# Altium schematic sheet 009_SoC SDIO & eMMC & SD.SchDoc
size 420 x 297 mm; Page Create Date: May 29, 2006; WebSite: https://www.seeedstudio.com; Page Number: 9; Drawing: qxn; Schematic Name: BeaglePlay; Page Size: A3; Comment: Seeed Title; Page Count: 22; Page Name: 009_SoC SDIO & eMMC & SD; Company: Seeed Studio; RevCode: v0.2; DsnPath: C:\Users\a0488739\Documents\GitHub\beagleplay\allegro\DVT\BEAGLEPLAYV020_220915.DSN; SchematicName: BeaglePlay; PageName: 009_SoC SDIO & eMMC & SD; PageSize: A3; TopSchematic: True
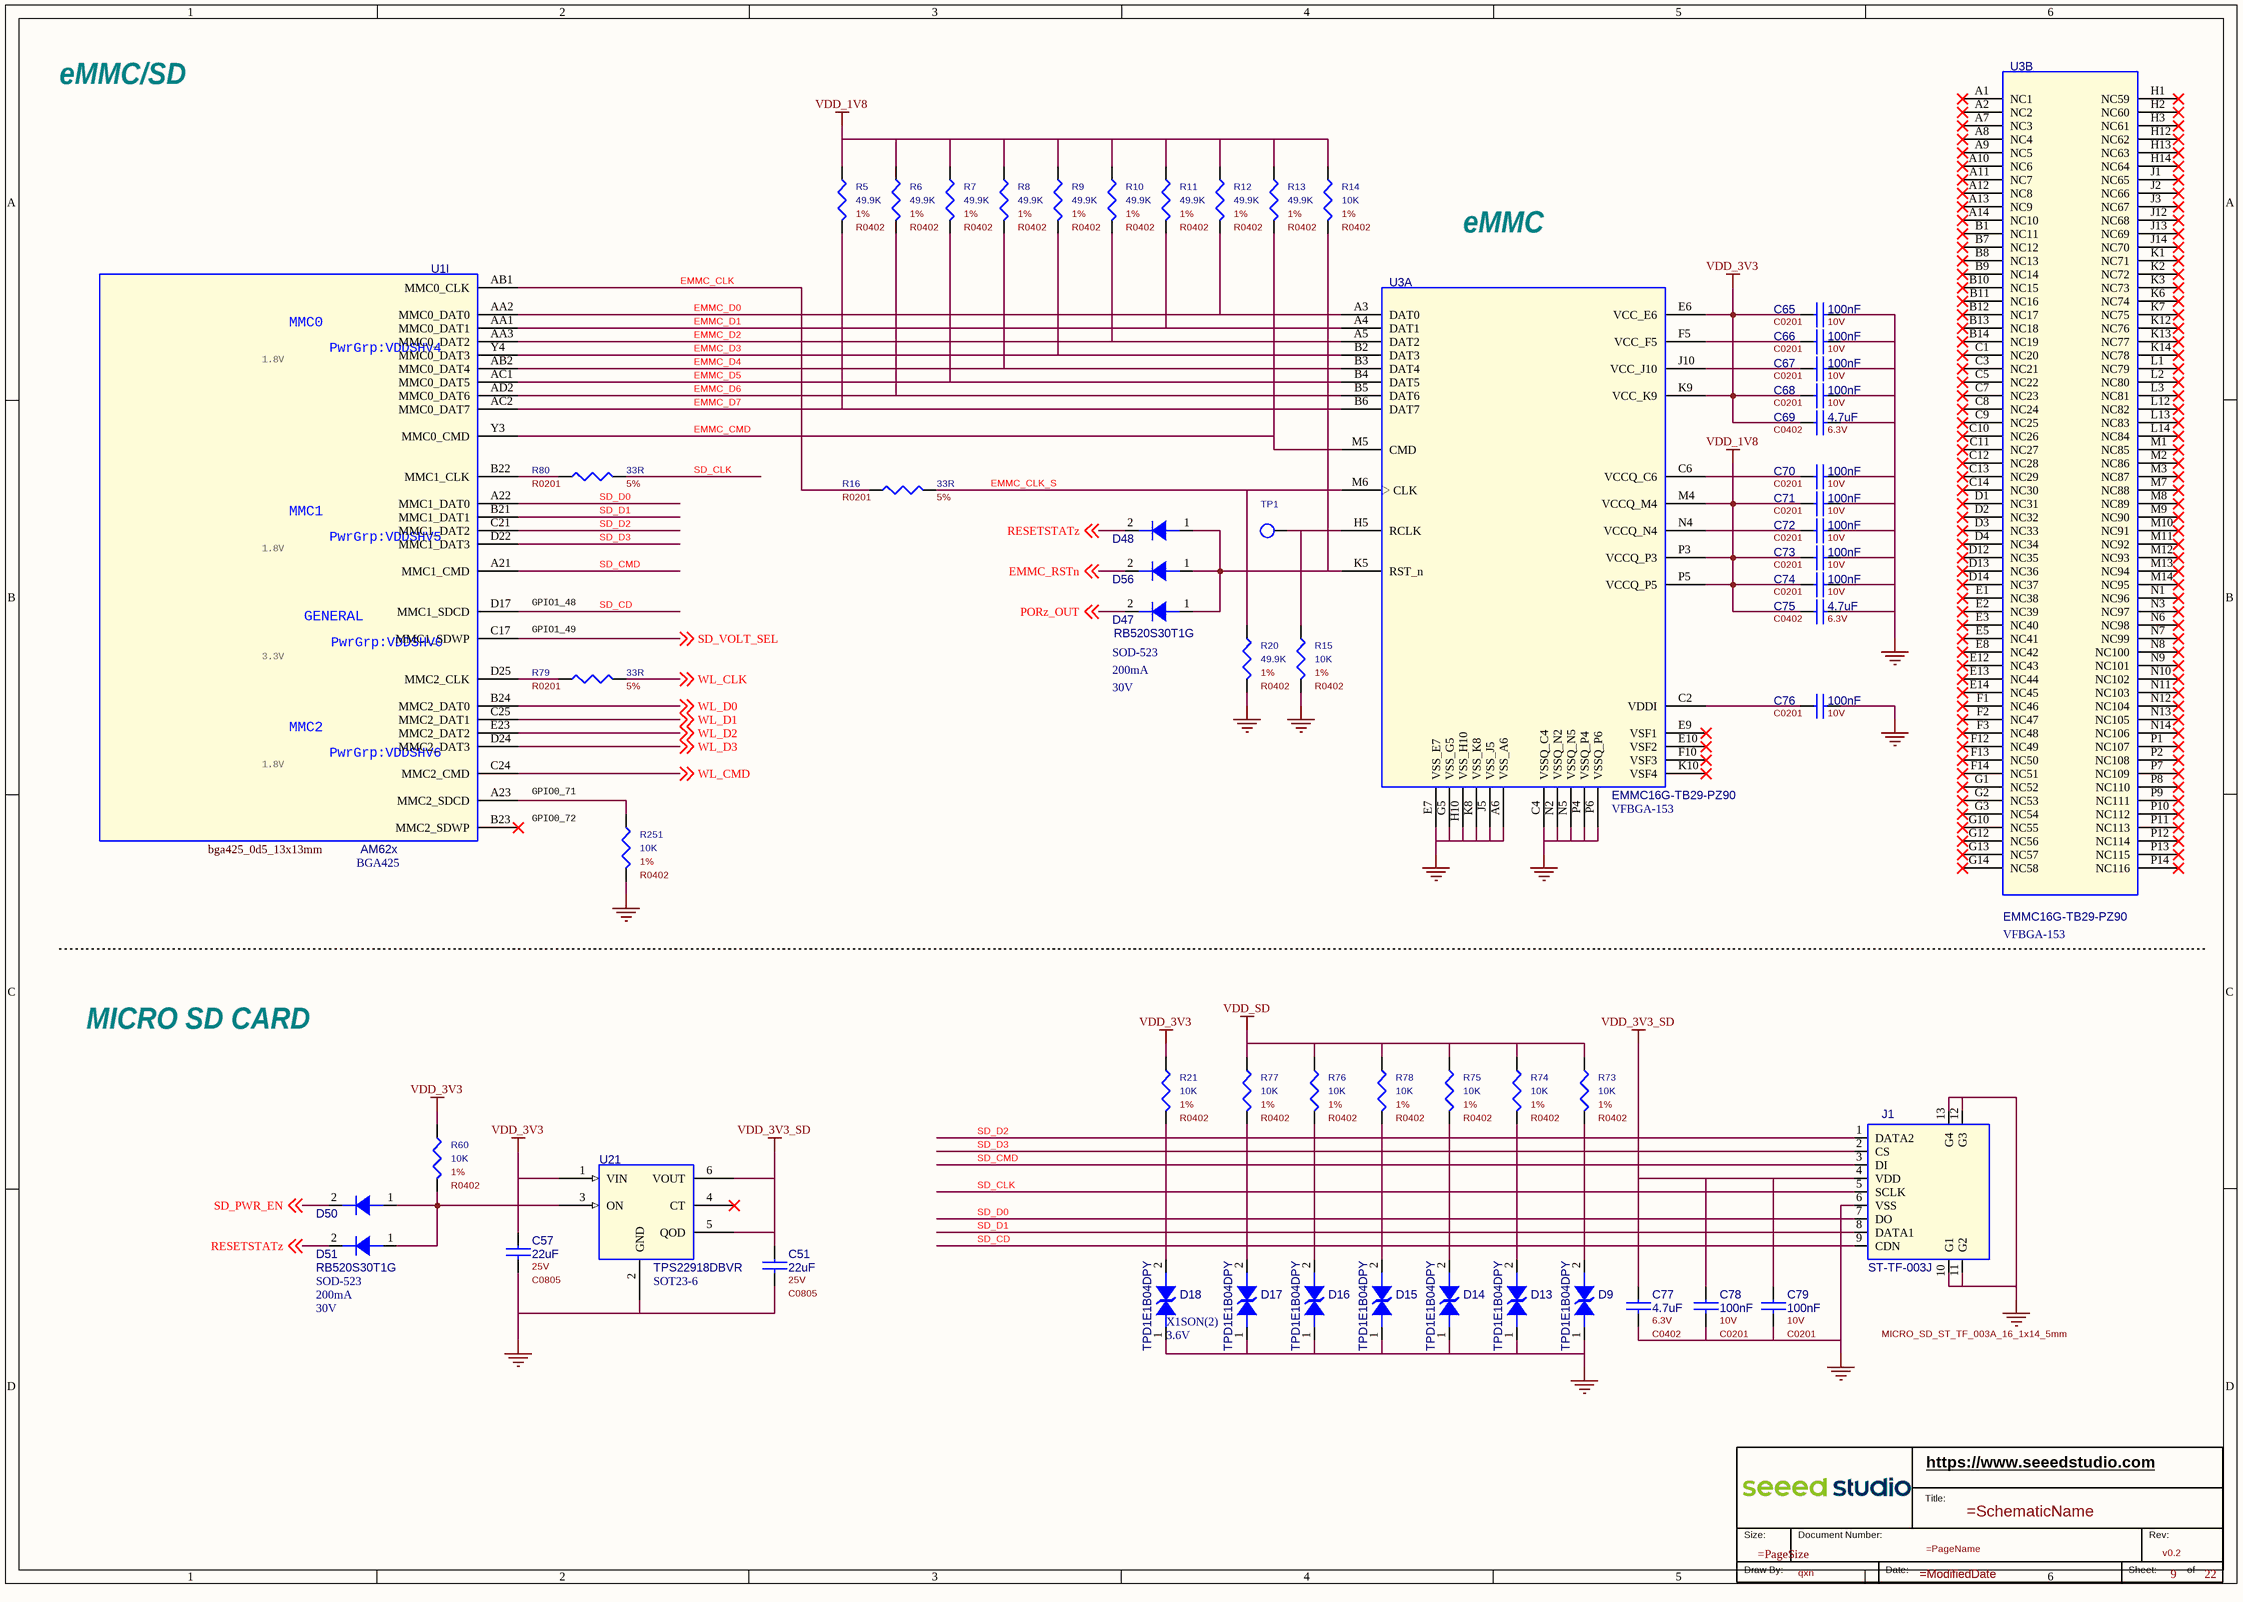
[diagram p0: 009_SoC SDIO & eMMC & SD.SchDoc]

## Parts
*  RevCode: v0.2  Page Number: 9  Page Count: 22  Drawing: qxn  (hidden comment: Seeed Title)  (graphical)
C51  value 22uF  Rating: 25V  [C0805]  (hidden comment: CC)
C57  value 22uF  Rating: 25V  [C0805]  (hidden comment: CC)
C65  value 100nF  Rating: 10V  [C0201]  (hidden comment: CC)
C66  value 100nF  Rating: 10V  [C0201]  (hidden comment: CC)
C67  value 100nF  Rating: 10V  [C0201]  (hidden comment: CC)
C68  value 100nF  Rating: 10V  [C0201]  (hidden comment: CC)
C69  value 4.7uF  Rating: 6.3V  [C0402]  (hidden comment: CC)
C70  value 100nF  Rating: 10V  [C0201]  (hidden comment: CC)
C71  value 100nF  Rating: 10V  [C0201]  (hidden comment: CC)
C72  value 100nF  Rating: 10V  [C0201]  (hidden comment: CC)
C73  value 100nF  Rating: 10V  [C0201]  (hidden comment: CC)
C74  value 100nF  Rating: 10V  [C0201]  (hidden comment: CC)
C75  value 4.7uF  Rating: 6.3V  [C0402]  (hidden comment: CC)
C76  value 100nF  Rating: 10V  [C0201]  (hidden comment: CC)
C77  value 4.7uF  Rating: 6.3V  [C0402]  (hidden comment: CC)
C78  value 100nF  Rating: 10V  [C0201]  (hidden comment: CC)
C79  value 100nF  Rating: 10V  [C0201]  (hidden comment: CC)
D9  value TPD1E1B04DPY  [D0402]  (hidden comment: DIODE TVS BI-DIR)
D13  value TPD1E1B04DPY  [D0402]  (hidden comment: DIODE TVS BI-DIR)
D14  value TPD1E1B04DPY  [D0402]  (hidden comment: DIODE TVS BI-DIR)
D15  value TPD1E1B04DPY  [D0402]  (hidden comment: DIODE TVS BI-DIR)
D16  value TPD1E1B04DPY  [D0402]  (hidden comment: DIODE TVS BI-DIR)
D17  value TPD1E1B04DPY  [D0402]  (hidden comment: DIODE TVS BI-DIR)
D18  value TPD1E1B04DPY  Package Size: X1SON(2)  Rated Voltage: 3.6V  [D0402]  (hidden comment: DIODE TVS BI-DIR)
D47  value RB520S30T1G  Package Size: SOD-523  Peak Forward Current: 200mA  Repetitive Reverse Voltage Maximum: 30V  [sod_523]  (hidden comment: D)
D48  D  [sod_523]  (value not drawn)
D50  D  [sod_523]  (value not drawn)
D51  value RB520S30T1G  Repetitive Reverse Voltage Maximum: 30V  Peak Forward Current: 200mA  Package Size: SOD-523  [sod_523]  (hidden comment: D)
D56  D  [sod_523]  (value not drawn)
J1  value ST-TF-003J  [MICRO_SD_ST_TF_003A_16_1x14_5mm]  (hidden comment: MicroSD Card_9+4P)
R5  value 49.9K  Rating: 1%  [R0402]  (hidden comment: R)
R6  value 49.9K  Rating: 1%  [R0402]  (hidden comment: R)
R7  value 49.9K  Rating: 1%  [R0402]  (hidden comment: R)
R8  value 49.9K  Rating: 1%  [R0402]  (hidden comment: R)
R9  value 49.9K  Rating: 1%  [R0402]  (hidden comment: R)
R10  value 49.9K  Rating: 1%  [R0402]  (hidden comment: R)
R11  value 49.9K  Rating: 1%  [R0402]  (hidden comment: R)
R12  value 49.9K  Rating: 1%  [R0402]  (hidden comment: R)
R13  value 49.9K  Rating: 1%  [R0402]  (hidden comment: R)
R14  value 10K  Rating: 1%  [R0402]  (hidden comment: R)
R15  value 10K  Rating: 1%  [R0402]  (hidden comment: R)
R16  value 33R  Rating: 5%  [R0201]  (hidden comment: R)
R20  value 49.9K  Rating: 1%  [R0402]  (hidden comment: R)
R21  value 10K  Rating: 1%  [R0402]  (hidden comment: R)
R60  value 10K  Rating: 1%  [R0402]  (hidden comment: R)
R73  value 10K  Rating: 1%  [R0402]  (hidden comment: R)
R74  value 10K  Rating: 1%  [R0402]  (hidden comment: R)
R75  value 10K  Rating: 1%  [R0402]  (hidden comment: R)
R76  value 10K  Rating: 1%  [R0402]  (hidden comment: R)
R77  value 10K  Rating: 1%  [R0402]  (hidden comment: R)
R78  value 10K  Rating: 1%  [R0402]  (hidden comment: R)
R79  value 33R  Rating: 5%  [R0201]  (hidden comment: R)
R80  value 33R  Rating: 5%  [R0201]  (hidden comment: R)
R251  value 10K  Rating: 1%  [R0402]  (hidden comment: R)
TP1  Test Point  [tp1-8040]  (value not drawn)
U1  value AM62x  Package Size: BGA425  [bga425_0d5_13x13mm]  (hidden comment: AM62x_BGA425)  (part I of 19)
U3  value EMMC16G-TB29-PZ90  Package Size: VFBGA-153  [BGA153_P14_P5_11P5X13]  (hidden comment: eMMC_1)  (parts A,B of 2)
U21  value TPS22918DBVR  Package Size: SOT23-6  [sot23_6]  (hidden comment: TPS22918DBV)

## Nets
GND: C51.2 C57.2 C65.2 C66.2 C67.2 C68.2 C69.2 C70.2 C71.2 C72.2 C73.2 C74.2 C75.2 C76.2 C77.2 C78.2 C79.2 D9.1 D13.1 D14.1 D15.1 D16.1 D17.1 D18.1 J1.6(VSS) J1.10(G1) J1.11(G2) J1.12(G3) J1.13(G4) R15.2 R20.2 R251.2 U3.A6(VSS_A6) U3.C4(VSSQ_C4) U3.E7(VSS_E7) U3.G5(VSS_G5) U3.H10(VSS_H10) U3.J5(VSS_J5) U3.K8(VSS_K8) U3.N2(VSSQ_N2) U3.N5(VSSQ_N5) U3.P4(VSSQ_P4) U3.P6(VSSQ_P6) U21.2(GND)
VDD_1V8: C70.1 C71.1 C72.1 C73.1 C74.1 C75.1 R5.1 R6.1 R7.1 R8.1 R9.1 R10.1 R11.1 R12.1 R13.1 R14.1 U3.C6(VCCQ_C6) U3.M4(VCCQ_M4) U3.N4(VCCQ_N4) U3.P3(VCCQ_P3) U3.P5(VCCQ_P5)
VDD_3V3: C57.1 C65.1 C66.1 C67.1 C68.1 C69.1 R21.1 R60.1 U3.E6(VCC_E6) U3.F5(VCC_F5) U3.J10(VCC_J10) U3.K9(VCC_K9) U21.1(VIN)
VDD_3V3_SD: C51.1 C77.1 C78.1 C79.1 J1.4(VDD) U21.5(QOD) U21.6(VOUT)
VDD_SD: R73.1 R74.1 R75.1 R76.1 R77.1 R78.1
EMMC_CLK: R16.1 U1.AB1(MMC0_CLK)
EMMC_CLK_S: R16.2 R20.1 U3.M6(CLK)
EMMC_CMD: R13.2 U1.Y3(MMC0_CMD) U3.M5(CMD)
EMMC_D0: R12.2 U1.AA2(MMC0_DAT0) U3.A3(DAT0)
EMMC_D1: R11.2 U1.AA1(MMC0_DAT1) U3.A4(DAT1)
EMMC_D2: R10.2 U1.AA3(MMC0_DAT2) U3.A5(DAT2)
EMMC_D3: R9.2 U1.Y4(MMC0_DAT3) U3.B2(DAT3)
EMMC_D4: R8.2 U1.AB2(MMC0_DAT4) U3.B3(DAT4)
EMMC_D5: R7.2 U1.AC1(MMC0_DAT5) U3.B4(DAT5)
EMMC_D6: R6.2 U1.AD2(MMC0_DAT6) U3.B5(DAT6)
EMMC_D7: R5.2 U1.AC2(MMC0_DAT7) U3.B6(DAT7)
EMMC_RSTn: D56.2(C) ; off-sheet EMMC_RSTn
PORz_OUT: D47.2(C) ; off-sheet PORz_OUT
RESETSTATz: D48.2(C) D51.2(C) ; off-sheet RESETSTATz
SD_CD: D18.2 J1.9(CDN) R21.2 U1.D17(MMC1_SDCD)
SD_CLK: D14.2 J1.5(SCLK) R75.2 R80.2
SD_CMD: D15.2 J1.3(DI) R78.2 U1.A21(MMC1_CMD)
SD_D0: D13.2 J1.7(DO) R74.2 U1.A22(MMC1_DAT0)
SD_D1: D9.2 J1.8(DATA1) R73.2 U1.B21(MMC1_DAT1)
SD_D2: D17.2 J1.1(DATA2) R77.2 U1.C21(MMC1_DAT2)
SD_D3: D16.2 J1.2(CS) R76.2 U1.D22(MMC1_DAT3)
SD_PWR_EN: D50.2(C) ; off-sheet SD_PWR_EN
SD_VOLT_SEL: U1.C17(MMC1_SDWP) ; off-sheet SD_VOLT_SEL
WL_CLK: R79.2 ; off-sheet WL_CLK
WL_CMD: U1.C24(MMC2_CMD) ; off-sheet WL_CMD
WL_D0: U1.B24(MMC2_DAT0) ; off-sheet WL_D0
WL_D1: U1.C25(MMC2_DAT1) ; off-sheet WL_D1
WL_D2: U1.E23(MMC2_DAT2) ; off-sheet WL_D2
WL_D3: U1.D24(MMC2_DAT3) ; off-sheet WL_D3
NetC76_1: C76.1 U3.C2(VDDI)
NetD47_1: D47.1(A) D48.1(A) D56.1(A) R14.2 U3.K5(RST_n)
NetD50_1: D50.1(A) D51.1(A) R60.2 U21.3(ON)
NetR15_1: R15.1 TP1.1(TP) U3.H5(RCLK)
NetR79_1: R79.1 U1.D25(MMC2_CLK)
NetR80_1: R80.1 U1.B22(MMC1_CLK)
NetR251_1: R251.1 U1.A23(MMC2_SDCD)

Not connected (* = marked no-connect by the designer): U1 B23(MMC2_SDWP)*; U3 A1(NC1)* A2(NC2)* A7(NC3)* A8(NC4)* A9(NC5)* A10(NC6)* A11(NC7)* A12(NC8)* A13(NC9)* A14(NC10)* B1(NC11)* B7(NC12)* B8(NC13)* B9(NC14)* B10(NC15)* B11(NC16)* B12(NC17)* B13(NC18)* B14(NC19)* C1(NC20)* C3(NC21)* C5(NC22)* C7(NC23)* C8(NC24)* C9(NC25)* C10(NC26)* C11(NC27)* C12(NC28)* C13(NC29)* C14(NC30)* D1(NC31)* D2(NC32)* D3(NC33)* D4(NC34)* D12(NC35)* D13(NC36)* D14(NC37)* E1(NC38)* E2(NC39)* E3(NC40)* E5(NC41)* E8(NC42)* E9(VSF1)* E10(VSF2)* E12(NC43)* E13(NC44)* E14(NC45)* F1(NC46)* F2(NC47)* F3(NC48)* F10(VSF3)* F12(NC49)* F13(NC50)* F14(NC51)* G1(NC52)* G2(NC53)* G3(NC54)* G10(NC55)* G12(NC56)* G13(NC57)* G14(NC58)* H1(NC59)* H2(NC60)* H3(NC61)* H12(NC62)* H13(NC63)* H14(NC64)* J1(NC65)* J2(NC66)* J3(NC67)* J12(NC68)* J13(NC69)* J14(NC70)* K1(NC71)* K2(NC72)* K3(NC73)* K6(NC74)* K7(NC75)* K10(VSF4)* K12(NC76)* K13(NC77)* K14(NC78)* L1(NC79)* L2(NC80)* L3(NC81)* L12(NC82)* L13(NC83)* L14(NC84)* M1(NC85)* M2(NC86)* M3(NC87)* M7(NC88)* M8(NC89)* M9(NC90)* M10(NC91)* M11(NC92)* M12(NC93)* M13(NC94)* M14(NC95)* N1(NC96)* N3(NC97)* N6(NC98)* N7(NC99)* N8(NC100)* N9(NC101)* N10(NC102)* N11(NC103)* N12(NC104)* N13(NC105)* N14(NC106)* P1(NC107)* P2(NC108)* P7(NC109)* P8(NC110)* P9(NC111)* P10(NC112)* P11(NC113)* P12(NC114)* P13(NC115)* P14(NC116)*; U21 4(CT)*

## Notes on the sheet
- eMMC/SD
- eMMC
- 1.8V
- 3.3V
- GPIO1_48
- GPIO1_49
- GPIO0_71
- GPIO0_72
- MICRO SD CARD
- (in symbol AM62x_BGA425, part I) MMC0; PwrGrp:VDDSHV4; MMC1; PwrGrp:VDDSHV5; GENERAL; PwrGrp:VDDSHV0; MMC2; PwrGrp:VDDSHV6
- (in symbol Seeed Title) https://www.seeedstudio.com; Title:; Size:; Document Number:; Rev:; Draw By:; Date:; Sheet:; of

## Library data of the parts
* = Seeed Title: Company: Seeed Studio; WebSite: https://www.seeedstudio.com; Schematic Name: =SchematicName; Page Size: =PageSize; Page Name: =PageName; Page Create Date: May 29, 2006; Page Modify Date: =ModifiedDate
C51 = CC: CAP, Ceramic, SMD, 22uF, 20%, 25V, 0805; Part Reference: C51; Manufacturer PN: CC0805MKX5R8BB226; Manufacturer: YAGEO; Company Part Status: SenseCAP SOLO CO2 v1.0; CLASS: DISCRETE; Temperature Coefficient: X5R; PN: 302010235; PCB Footprint: C0805; Tolerance: 20%; Dielectric Type: Ceramic; Package Size: 0805
C57 = CC: CAP, Ceramic, SMD, 22uF, 20%, 25V, 0805; Part Reference: C57; Company Part Status: SenseCAP SOLO CO2 v1.0; Manufacturer: YAGEO; Manufacturer PN: CC0805MKX5R8BB226; PN: 302010235; Temperature Coefficient: X5R; CLASS: DISCRETE; PCB Footprint: C0805; Package Size: 0805; Dielectric Type: Ceramic; Tolerance: 20%
C65 = CC: CAP, Ceramic, SMD, 100nF, 10%, 10V, 0201; Part Reference: C65; Company Part Status: ODYSSEY-i.MX8M; Manufacturer: YAGEO; Manufacturer PN: CC0201KRX5R6BB104; PN: 302010271; Temperature Coefficient: X5R; CLASS: DISCRETE; SIGNAL_MODEL: DEFAULT_CAPACITOR_100000pF_1_2; PCB Footprint: C0201; Package Size: 0201; Dielectric Type: Ceramic; Tolerance: 10%
C66 = CC: CAP, Ceramic, SMD, 100nF, 10%, 10V, 0201; Part Reference: C66; Company Part Status: ODYSSEY-i.MX8M; Manufacturer: YAGEO; Manufacturer PN: CC0201KRX5R6BB104; PN: 302010271; Temperature Coefficient: X5R; CLASS: DISCRETE; SIGNAL_MODEL: DEFAULT_CAPACITOR_100000pF_1_2; PCB Footprint: C0201; Package Size: 0201; Dielectric Type: Ceramic; Tolerance: 10%
C67 = CC: CAP, Ceramic, SMD, 100nF, 10%, 10V, 0201; Part Reference: C67; Company Part Status: ODYSSEY-i.MX8M; Manufacturer: YAGEO; Manufacturer PN: CC0201KRX5R6BB104; PN: 302010271; Temperature Coefficient: X5R; CLASS: DISCRETE; SIGNAL_MODEL: DEFAULT_CAPACITOR_100000pF_1_2; PCB Footprint: C0201; Package Size: 0201; Dielectric Type: Ceramic; Tolerance: 10%
C68 = CC: CAP, Ceramic, SMD, 100nF, 10%, 10V, 0201; Part Reference: C68; Company Part Status: ODYSSEY-i.MX8M; Manufacturer: YAGEO; Manufacturer PN: CC0201KRX5R6BB104; PN: 302010271; Temperature Coefficient: X5R; CLASS: DISCRETE; SIGNAL_MODEL: DEFAULT_CAPACITOR_100000pF_1_2; PCB Footprint: C0201; Package Size: 0201; Dielectric Type: Ceramic; Tolerance: 10%
C69 = CC: CAP, Ceramic, SMD, 4.7uF, 20%, 6.3V, 0402; Part Reference: C69; Manufacturer PN: CC0402MRX5R5BB475; Manufacturer: YAGEO; Company Part Status: BeagleBone Carrier Board; CLASS: DISCRETE; Temperature Coefficient: X5R; PN: 302010019; SIGNAL_MODEL: DEFAULT_CAPACITOR_4.7e+06pF_1_2; PCB Footprint: C0402; Tolerance: 20%; Dielectric Type: Ceramic; Package Size: 0402
C70 = CC: CAP, Ceramic, SMD, 100nF, 10%, 10V, 0201; Part Reference: C70; Manufacturer PN: CC0201KRX5R6BB104; Manufacturer: YAGEO; Company Part Status: ODYSSEY-i.MX8M; CLASS: DISCRETE; Temperature Coefficient: X5R; PN: 302010271; SIGNAL_MODEL: DEFAULT_CAPACITOR_100000pF_1_2; PCB Footprint: C0201; Tolerance: 10%; Dielectric Type: Ceramic; Package Size: 0201
C71 = CC: CAP, Ceramic, SMD, 100nF, 10%, 10V, 0201; Part Reference: C71; Manufacturer PN: CC0201KRX5R6BB104; Manufacturer: YAGEO; Company Part Status: ODYSSEY-i.MX8M; CLASS: DISCRETE; Temperature Coefficient: X5R; PN: 302010271; SIGNAL_MODEL: DEFAULT_CAPACITOR_100000pF_1_2; PCB Footprint: C0201; Tolerance: 10%; Dielectric Type: Ceramic; Package Size: 0201
C72 = CC: CAP, Ceramic, SMD, 100nF, 10%, 10V, 0201; Part Reference: C72; Manufacturer PN: CC0201KRX5R6BB104; Manufacturer: YAGEO; Company Part Status: ODYSSEY-i.MX8M; CLASS: DISCRETE; Temperature Coefficient: X5R; PN: 302010271; SIGNAL_MODEL: DEFAULT_CAPACITOR_100000pF_1_2; PCB Footprint: C0201; Tolerance: 10%; Dielectric Type: Ceramic; Package Size: 0201
C73 = CC: CAP, Ceramic, SMD, 100nF, 10%, 10V, 0201; Part Reference: C73; Manufacturer PN: CC0201KRX5R6BB104; Manufacturer: YAGEO; Company Part Status: ODYSSEY-i.MX8M; CLASS: DISCRETE; Temperature Coefficient: X5R; PN: 302010271; SIGNAL_MODEL: DEFAULT_CAPACITOR_100000pF_1_2; PCB Footprint: C0201; Tolerance: 10%; Dielectric Type: Ceramic; Package Size: 0201
C74 = CC: CAP, Ceramic, SMD, 100nF, 10%, 10V, 0201; Part Reference: C74; Company Part Status: ODYSSEY-i.MX8M; Manufacturer: YAGEO; Manufacturer PN: CC0201KRX5R6BB104; PN: 302010271; Temperature Coefficient: X5R; CLASS: DISCRETE; SIGNAL_MODEL: DEFAULT_CAPACITOR_100000pF_1_2; PCB Footprint: C0201; Package Size: 0201; Dielectric Type: Ceramic; Tolerance: 10%
C75 = CC: CAP, Ceramic, SMD, 4.7uF, 20%, 6.3V, 0402; Part Reference: C75; Manufacturer PN: CC0402MRX5R5BB475; Manufacturer: YAGEO; Company Part Status: BeagleBone Carrier Board; CLASS: DISCRETE; Temperature Coefficient: X5R; PN: 302010019; SIGNAL_MODEL: DEFAULT_CAPACITOR_4.7e+06pF_1_2; PCB Footprint: C0402; Tolerance: 20%; Dielectric Type: Ceramic; Package Size: 0402
C76 = CC: CAP, Ceramic, SMD, 100nF, 10%, 10V, 0201; Part Reference: C76; Manufacturer PN: CC0201KRX5R6BB104; Manufacturer: YAGEO; Company Part Status: ODYSSEY-i.MX8M; CLASS: DISCRETE; Temperature Coefficient: X5R; PN: 302010271; SIGNAL_MODEL: DEFAULT_CAPACITOR_100000pF_1_2; PCB Footprint: C0201; Tolerance: 10%; Dielectric Type: Ceramic; Package Size: 0201
C77 = CC: CAP, Ceramic, SMD, 4.7uF, 20%, 6.3V, 0402; Part Reference: C77; Company Part Status: BeagleBone Carrier Board; Manufacturer: YAGEO; Manufacturer PN: CC0402MRX5R5BB475; PN: 302010019; Temperature Coefficient: X5R; CLASS: DISCRETE; SIGNAL_MODEL: DEFAULT_CAPACITOR_4.7e+06pF_1_2; PCB Footprint: C0402; Package Size: 0402; Dielectric Type: Ceramic; Tolerance: 20%
C78 = CC: CAP, Ceramic, SMD, 100nF, 10%, 10V, 0201; Part Reference: C78; Manufacturer PN: CC0201KRX5R6BB104; Manufacturer: YAGEO; Company Part Status: ODYSSEY-i.MX8M; CLASS: DISCRETE; Temperature Coefficient: X5R; PN: 302010271; SIGNAL_MODEL: DEFAULT_CAPACITOR_100000pF_1_2; PCB Footprint: C0201; Tolerance: 10%; Dielectric Type: Ceramic; Package Size: 0201
C79 = CC: CAP, Ceramic, SMD, 100nF, 10%, 10V, 0201; Part Reference: C79; Company Part Status: ODYSSEY-i.MX8M; Manufacturer: YAGEO; Manufacturer PN: CC0201KRX5R6BB104; PN: 302010271; Temperature Coefficient: X5R; CLASS: DISCRETE; SIGNAL_MODEL: DEFAULT_CAPACITOR_100000pF_1_2; PCB Footprint: C0201; Package Size: 0201; Dielectric Type: Ceramic; Tolerance: 10%
D9 = DIODE TVS BI-DIR: DIO, ESD, TPD1E1B04DPY, --, 3.6V, --, X1SON(2); Part Reference: D9; Manufacturer Part Number: TPD1E1B04DPYR/T; Manufacturer: TI; Company Part Status: Grove Base Cape for PocketBeagle; Manufacturer PN: TPD1E1B04DPYR; PN: 304050798; CLASS: DISCRETE; PCB Footprint: D0402; Temperature: -40¡ãC to 125¡ãC; Status: Grove Base Cape for PocketBeagle; Part Type: ESD; Package Size: X1SON(2); Rated Voltage: 3.6V
D13 = DIODE TVS BI-DIR: DIO, ESD, TPD1E1B04DPY, --, 3.6V, --, X1SON(2); Part Reference: D13; Manufacturer Part Number: TPD1E1B04DPYR/T; Manufacturer: TI; Company Part Status: Grove Base Cape for PocketBeagle; Manufacturer PN: TPD1E1B04DPYR; PN: 304050798; CLASS: DISCRETE; PCB Footprint: D0402; Temperature: -40¡ãC to 125¡ãC; Status: Grove Base Cape for PocketBeagle; Part Type: ESD; Package Size: X1SON(2); Rated Voltage: 3.6V
D14 = DIODE TVS BI-DIR: DIO, ESD, TPD1E1B04DPY, --, 3.6V, --, X1SON(2); Part Reference: D14; Manufacturer Part Number: TPD1E1B04DPYR/T; Manufacturer: TI; Company Part Status: Grove Base Cape for PocketBeagle; Manufacturer PN: TPD1E1B04DPYR; PN: 304050798; CLASS: DISCRETE; PCB Footprint: D0402; Temperature: -40¡ãC to 125¡ãC; Status: Grove Base Cape for PocketBeagle; Part Type: ESD; Package Size: X1SON(2); Rated Voltage: 3.6V
D15 = DIODE TVS BI-DIR: DIO, ESD, TPD1E1B04DPY, --, 3.6V, --, X1SON(2); Part Reference: D15; Manufacturer Part Number: TPD1E1B04DPYR/T; Manufacturer: TI; Company Part Status: Grove Base Cape for PocketBeagle; Manufacturer PN: TPD1E1B04DPYR; PN: 304050798; CLASS: DISCRETE; PCB Footprint: D0402; Temperature: -40¡ãC to 125¡ãC; Status: Grove Base Cape for PocketBeagle; Part Type: ESD; Package Size: X1SON(2); Rated Voltage: 3.6V
D16 = DIODE TVS BI-DIR: DIO, ESD, TPD1E1B04DPY, --, 3.6V, --, X1SON(2); Part Reference: D16; Manufacturer Part Number: TPD1E1B04DPYR/T; Manufacturer: TI; Company Part Status: Grove Base Cape for PocketBeagle; Manufacturer PN: TPD1E1B04DPYR; PN: 304050798; CLASS: DISCRETE; PCB Footprint: D0402; Temperature: -40¡ãC to 125¡ãC; Status: Grove Base Cape for PocketBeagle; Part Type: ESD; Package Size: X1SON(2); Rated Voltage: 3.6V
D17 = DIODE TVS BI-DIR: DIO, ESD, TPD1E1B04DPY, --, 3.6V, --, X1SON(2); Part Reference: D17; Manufacturer Part Number: TPD1E1B04DPYR/T; Manufacturer: TI; Company Part Status: Grove Base Cape for PocketBeagle; Manufacturer PN: TPD1E1B04DPYR; PN: 304050798; CLASS: DISCRETE; PCB Footprint: D0402; Temperature: -40¡ãC to 125¡ãC; Status: Grove Base Cape for PocketBeagle; Part Type: ESD; Package Size: X1SON(2); Rated Voltage: 3.6V
D18 = DIODE TVS BI-DIR: DIO, ESD, TPD1E1B04DPY, --, 3.6V, --, X1SON(2); Part Reference: D18; Manufacturer Part Number: TPD1E1B04DPYR/T; Manufacturer: TI; Company Part Status: Grove Base Cape for PocketBeagle; Manufacturer PN: TPD1E1B04DPYR; PN: 304050798; CLASS: DISCRETE; PCB Footprint: D0402; Temperature: -40¡ãC to 125¡ãC; Status: Grove Base Cape for PocketBeagle; Part Type: ESD
D47 = D: DIO, Schottky, RB520S30T1G, , , , SOD-523; Part Reference: D47; Company Part Status: SCG Vehicle Device; Manufacturer: ON; PN: 304020782; CLASS: DISCRETE; PCB Footprint: sod_523; Manufacturer PN: RB520S30T1G
D48 = D: DIO, Schottky, RB520S30T1G, , , , SOD-523; Part Reference: D48; Company Part Status: SCG Vehicle Device; Manufacturer: ON; PN: 304020782; Peak Forward Current: 200mA; Repetitive Reverse Voltage Maximum: 30V; CLASS: DISCRETE; PCB Footprint: sod_523; Value: RB520S30T1G; Package Size: SOD-523; Manufacturer PN: RB520S30T1G
D50 = D: DIO, Schottky, RB520S30T1G, , , , SOD-523; Part Reference: D50; Manufacturer: ON; Company Part Status: SCG Vehicle Device; CLASS: DISCRETE; Repetitive Reverse Voltage Maximum: 30V; Peak Forward Current: 200mA; PN: 304020782; PCB Footprint: sod_523; Value: RB520S30T1G; Manufacturer PN: RB520S30T1G; Package Size: SOD-523
D51 = D: DIO, Schottky, RB520S30T1G, , , , SOD-523; Part Reference: D51; Manufacturer: ON; Company Part Status: SCG Vehicle Device; CLASS: DISCRETE; PN: 304020782; PCB Footprint: sod_523; Manufacturer PN: RB520S30T1G
D56 = D: DIO, Schottky, RB520S30T1G, , , , SOD-523; Part Reference: D56; Company Part Status: SCG Vehicle Device; Manufacturer: ON; PN: 304020782; Peak Forward Current: 200mA; Repetitive Reverse Voltage Maximum: 30V; CLASS: DISCRETE; PCB Footprint: sod_523; Value: RB520S30T1G; Package Size: SOD-523; Manufacturer PN: RB520S30T1G
J1 = MicroSD Card_9+4P: CONN, SD Card, 9P, SMD; Part Reference: J1; Company Part Status: Eagleye 310s; Manufacturer: SUNGTECH; PN: 320090000; CLASS: IO; PCB Footprint: MICRO_SD_ST_TF_003A_16_1x14_5mm; Package Size: 9P-L14.7*W13.8*H1.0mm; Manufacturer PN: ST-TF-003J
R5 = R: RES, Thick Film, 49.9K, 1%, 1/16W, SMD, 0402; Part Reference: R5; Manufacturer PN: RC0402FR-0749K9L; Manufacturer: YAGEO; CLASS: DISCRETE; PN: 301010457; SIGNAL_MODEL: DEFAULT_RESISTOR_49900OHM_1_2; PCB Footprint: R0402; Rated Power: 1/16W; Package Size: 0402
R6 = R: RES, Thick Film, 49.9K, 1%, 1/16W, SMD, 0402; Part Reference: R6; Manufacturer: YAGEO; Manufacturer PN: RC0402FR-0749K9L; SIGNAL_MODEL: DEFAULT_RESISTOR_49900OHM_1_2; PN: 301010457; CLASS: DISCRETE; PCB Footprint: R0402; Package Size: 0402; Rated Power: 1/16W
R7 = R: RES, Thick Film, 49.9K, 1%, 1/16W, SMD, 0402; Part Reference: R7; Manufacturer PN: RC0402FR-0749K9L; Manufacturer: YAGEO; CLASS: DISCRETE; PN: 301010457; SIGNAL_MODEL: DEFAULT_RESISTOR_49900OHM_1_2; PCB Footprint: R0402; Rated Power: 1/16W; Package Size: 0402
R8 = R: RES, Thick Film, 49.9K, 1%, 1/16W, SMD, 0402; Part Reference: R8; Manufacturer PN: RC0402FR-0749K9L; Manufacturer: YAGEO; CLASS: DISCRETE; PN: 301010457; SIGNAL_MODEL: DEFAULT_RESISTOR_49900OHM_1_2; PCB Footprint: R0402; Rated Power: 1/16W; Package Size: 0402
R9 = R: RES, Thick Film, 49.9K, 1%, 1/16W, SMD, 0402; Part Reference: R9; Manufacturer: YAGEO; Manufacturer PN: RC0402FR-0749K9L; SIGNAL_MODEL: DEFAULT_RESISTOR_49900OHM_1_2; PN: 301010457; CLASS: DISCRETE; PCB Footprint: R0402; Package Size: 0402; Rated Power: 1/16W
R10 = R: RES, Thick Film, 49.9K, 1%, 1/16W, SMD, 0402; Part Reference: R10; Manufacturer: YAGEO; Manufacturer PN: RC0402FR-0749K9L; SIGNAL_MODEL: DEFAULT_RESISTOR_49900OHM_1_2; PN: 301010457; CLASS: DISCRETE; PCB Footprint: R0402; Package Size: 0402; Rated Power: 1/16W
R11 = R: RES, Thick Film, 49.9K, 1%, 1/16W, SMD, 0402; Part Reference: R11; Manufacturer PN: RC0402FR-0749K9L; Manufacturer: YAGEO; CLASS: DISCRETE; PN: 301010457; SIGNAL_MODEL: DEFAULT_RESISTOR_49900OHM_1_2; PCB Footprint: R0402; Rated Power: 1/16W; Package Size: 0402
R12 = R: RES, Thick Film, 49.9K, 1%, 1/16W, SMD, 0402; Part Reference: R12; Manufacturer: YAGEO; Manufacturer PN: RC0402FR-0749K9L; SIGNAL_MODEL: DEFAULT_RESISTOR_49900OHM_1_2; PN: 301010457; CLASS: DISCRETE; PCB Footprint: R0402; Package Size: 0402; Rated Power: 1/16W
R13 = R: RES, Thick Film, 49.9K, 1%, 1/16W, SMD, 0402; Part Reference: R13; Manufacturer: YAGEO; Manufacturer PN: RC0402FR-0749K9L; SIGNAL_MODEL: DEFAULT_RESISTOR_49900OHM_1_2; PN: 301010457; CLASS: DISCRETE; PCB Footprint: R0402; Package Size: 0402; Rated Power: 1/16W
R14 = R: RES, Thick Film, 10K, 1%, 1/16W, SMD, 0402; Part Reference: R14; Company Part Status: BeagleBone Carrier Board; Manufacturer: YAGEO; Manufacturer PN: RC0402FR-0710KL; SIGNAL_MODEL: DEFAULT_RESISTOR_10000OHM_1_2; PN: 301010047; CLASS: DISCRETE; PCB Footprint: R0402; Rated Power: 1/16W; Package Size: 0402
R15 = R: RES, Thick Film, 10K, 1%, 1/16W, SMD, 0402; Part Reference: R15; Company Part Status: BeagleBone Carrier Board; Manufacturer: YAGEO; Manufacturer PN: RC0402FR-0710KL; SIGNAL_MODEL: DEFAULT_RESISTOR_10000OHM_1_2; PN: 301010047; CLASS: DISCRETE; PCB Footprint: R0402; Rated Power: 1/16W; Package Size: 0402
R16 = R: RES, Thick Film, 33R, 5%, 1/20W, SMD, 0201; Part Reference: R16; Manufacturer PN: RC0201JR-0733RL; Manufacturer: YAGEO; Company Part Status: BeagleBone Carrier Board; CLASS: DISCRETE; PN: 301010675; PCB Footprint: R0201; Rated Power: 1/20W; Package Size: 0201
R20 = R: RES, Thick Film, 49.9K, 1%, 1/16W, SMD, 0402; Part Reference: R20; Manufacturer: YAGEO; Manufacturer PN: RC0402FR-0749K9L; SIGNAL_MODEL: DEFAULT_RESISTOR_49900OHM_1_2; PN: 301010457; CLASS: DISCRETE; PCB Footprint: R0402; Package Size: 0402; Rated Power: 1/16W
R21 = R: RES, Thick Film, 10K, 1%, 1/16W, SMD, 0402; Part Reference: R21; Manufacturer PN: RC0402FR-0710KL; Manufacturer: YAGEO; Company Part Status: BeagleBone Carrier Board; CLASS: DISCRETE; PN: 301010047; PCB Footprint: R0402; Package Size: 0402; Rated Power: 1/16W
R60 = R: RES, Thick Film, 10K, 1%, 1/16W, SMD, 0402; Part Reference: R60; Manufacturer PN: RC0402FR-0710KL; Manufacturer: YAGEO; Company Part Status: BeagleBone Carrier Board; CLASS: DISCRETE; PN: 301010047; PCB Footprint: R0402; Rated Power: 1/16W; Package Size: 0402
R73 = R: RES, Thick Film, 10K, 1%, 1/16W, SMD, 0402; Part Reference: R73; Company Part Status: BeagleBone Carrier Board; Manufacturer: YAGEO; Manufacturer PN: RC0402FR-0710KL; PN: 301010047; CLASS: DISCRETE; PCB Footprint: R0402; Rated Power: 1/16W; Package Size: 0402
R74 = R: RES, Thick Film, 10K, 1%, 1/16W, SMD, 0402; Part Reference: R74; Company Part Status: BeagleBone Carrier Board; Manufacturer: YAGEO; Manufacturer PN: RC0402FR-0710KL; PN: 301010047; CLASS: DISCRETE; PCB Footprint: R0402; Rated Power: 1/16W; Package Size: 0402
R75 = R: RES, Thick Film, 10K, 1%, 1/16W, SMD, 0402; Part Reference: R75; Company Part Status: BeagleBone Carrier Board; Manufacturer: YAGEO; Manufacturer PN: RC0402FR-0710KL; PN: 301010047; CLASS: DISCRETE; PCB Footprint: R0402; Rated Power: 1/16W; Package Size: 0402
R76 = R: RES, Thick Film, 10K, 1%, 1/16W, SMD, 0402; Part Reference: R76; Company Part Status: BeagleBone Carrier Board; Manufacturer: YAGEO; Manufacturer PN: RC0402FR-0710KL; PN: 301010047; CLASS: DISCRETE; PCB Footprint: R0402; Rated Power: 1/16W; Package Size: 0402
R77 = R: RES, Thick Film, 10K, 1%, 1/16W, SMD, 0402; Part Reference: R77; Company Part Status: BeagleBone Carrier Board; Manufacturer: YAGEO; Manufacturer PN: RC0402FR-0710KL; PN: 301010047; CLASS: DISCRETE; PCB Footprint: R0402; Rated Power: 1/16W; Package Size: 0402
R78 = R: RES, Thick Film, 10K, 1%, 1/16W, SMD, 0402; Part Reference: R78; Manufacturer PN: RC0402FR-0710KL; Manufacturer: YAGEO; Company Part Status: BeagleBone Carrier Board; CLASS: DISCRETE; PN: 301010047; PCB Footprint: R0402; Rated Power: 1/16W; Package Size: 0402
R79 = R: RES, Thick Film, 33R, 5%, 1/20W, SMD, 0201; Part Reference: R79; Company Part Status: BeagleBone Carrier Board; Manufacturer: YAGEO; Manufacturer PN: RC0201JR-0733RL; PN: 301010675; CLASS: DISCRETE; PCB Footprint: R0201; Package Size: 0201; Rated Power: 1/20W
R80 = R: RES, Thick Film, 33R, 5%, 1/20W, SMD, 0201; Part Reference: R80; Manufacturer PN: RC0201JR-0733RL; Manufacturer: YAGEO; Company Part Status: BeagleBone Carrier Board; CLASS: DISCRETE; PN: 301010675; PCB Footprint: R0201; Rated Power: 1/20W; Package Size: 0201
R251 = R: RES, Thick Film, 10K, 1%, 1/16W, SMD, 0402; Part Reference: R251; Company Part Status: BeagleBone Carrier Board; Manufacturer: YAGEO; Manufacturer PN: RC0402FR-0710KL; PN: 301010047; CLASS: DISCRETE; PCB Footprint: R0402; Rated Power: 1/16W; Package Size: 0402
TP1 = Test Point: MISC, Test Point, Test Point, SMD, TP35S_SMD; Part Reference: TP1; Company Part Status: Mini-Gateway; ASSY: DNP; CLASS: DISCRETE; PCB Footprint: TP35S_SMD; Value: Test Point; Package Size: TP35S_SMD; PN: TP35S_SMD
U1 = AM62x_BGA425: IC, Controller, MPU, AM62x, BGA425; Part Reference: U1; Manufacturer PN: AM6254ATCGGHALWR; Manufacturer: TI; Company Part Status: BeaglePlay; PN: 310011537; PCB Footprint: bga425_0d5_13x13mm; CLASS: IC
U3 = eMMC_1: IC, Memory Devices, eMMC, EMMC16G-TB29-PZ90, VFBGA-153; Part Reference: U3; Manufacturer: Kingston; Company Part Status: ODYSSEY-i.MX8M; SWAP_INFO: (S1+S2); SPLIT_INST: TRUE; PN: 310091085; PCB Footprint: BGA153_P14_P5_11P5X13; Manufacturer PN: EMMC16G-TB29-PZ90; CLASS: IC
U21 = TPS22918DBV: IC, PMIC, Power Switch, TPS22918DBVR, SOT23-6; Part Reference: U21; Manufacturer: TI; Company Part Status: BeagleBone AI TDA4VM; PN: 310032357; PCB Footprint: sot23_6; Manufacturer PN: TPS22918DBVR; CLASS: IC